# EAGLE design amp_project (EAGLE 9.6.2)
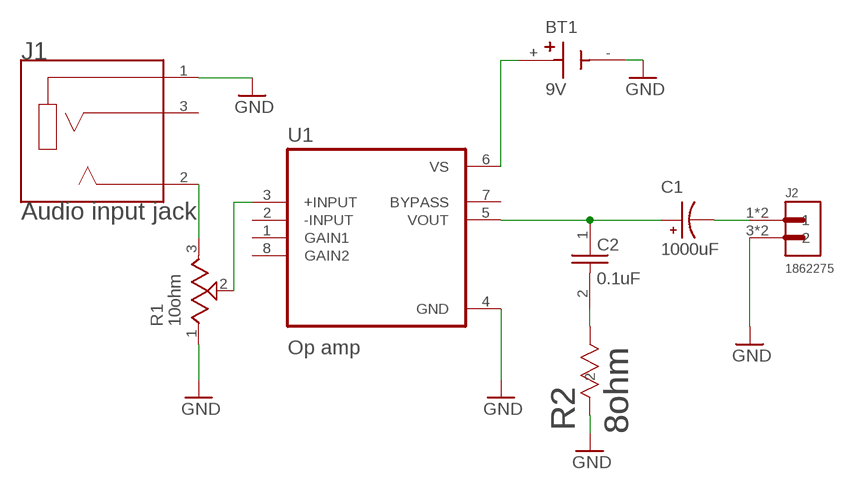
[diagram p0: schematic, sheet 1]

## Parts
BT1  9V  BH9VPC  [BAT_BH9VPC]
C1  1000uF  UPM1A102MHD6TO  [CAPPRD500W60D1250H1700]
C2  0.1uF  1C10X7R104K050B  [CAPRR254W51L508T318H635P]
J1  Audio input jack  SJ2-35853A-SMT-TR  [CUI_SJ2-35853A-SMT-TR]
J2  1862275  [PHOENIX_1862275]
R1  10ohm  3352T-1-103LF  [TRIM_3352T-1-103LF]
R2  8ohm  MRS25000C1009FCT00  [RES_MRS25_VIS]
U1  Op amp  LM386N-4/NOPB  [DIP794W45P254L959H508Q8]

## Nets
GND: BT1.- J1.1(SLEEVE) J2.3 J2.4 R1.1(CCW) R2.2 U1.4(GND)
N$1: J1.2(TIP) R1.3(CW)
N$2: R1.2(WIPER) U1.3(+INPUT)
N$3: BT1.+ U1.6(VS)
N$4: C1.P C2.1 U1.5(VOUT)
N$5: C1.N J2.1 J2.2
N$6: C2.2 R2.1
Unconnected: J1.3(RING) U1.1(GAIN1) U1.2(-INPUT) U1.7(BYPASS) U1.8(GAIN2)

## Library data of the parts
BT1 = BH9VPC:BH9VPC: 9V Battery Holder; DESCRIPTION: Battery Holder (Open) 9V 1 Cell PC Pin; DIGI-KEY_PART_NUMBER: BH9V-PC-ND; MF: MPD; MP: BH9VPC; PACKAGE: None; PURCHASE-URL: https://pricing.snapeda.com/search/part/BH9VPC/?ref=eda
C1 = UPM1A102MHD6TO:UPM1A102MHD6TO: CAP ALUM 1000UF 20% 10V RADIAL; DESCRIPTION: Cap Aluminum Lytic 1000uF 10V 20% (12.5 X 15mm) Radial 5mm 895mA 5000h 105°C Ammo; DIGI-KEY_PART_NUMBER: 493-12061-1-ND; MF: Nichicon; MP: UPM1A102MHD6TO; PACKAGE: Radial Nichicon; PURCHASE-URL: https://pricing.snapeda.com/search/part/UPM1A102MHD6TO/?ref=eda
C2 = 1C10X7R104K050B:1C10X7R104K050B: Cap Ceramic 0.1uF 50V X7R 10% Radial 2.54mm 125°C Bulk; DESCRIPTION: 0.1µF ±10% 50V Ceramic Capacitor X7R Radial; DIGI-KEY_PART_NUMBER: BC5209-ND; MF: Vishay BC; MP: 1C10X7R104K050B; PACKAGE: Radial Vishay; PURCHASE-URL: https://pricing.snapeda.com/search/part/1C10X7R104K050B/?ref=eda
J1 = SJ2-35853A-SMT-TR:SJ2-35853A-SMT-TR: 3 conductors, 3.5mm, SMT Audio Jack Check prices <https://pricing.snapeda.com/parts/SJ2-35853A-SMT-TR/CUI%20Devices/view-part?ref=eda>; AVAILABILITY: Good; CUI_PURCHASE_URL: https://www.cuidevices.com/product/interconnect/connectors/audio-connectors/jacks/sj2-3585x-smt-series?utm_source=snapeda.com&utm_medium=referral&utm_campaign=snapedaBOM; DESCRIPTION: 3.5 mm, Stereo, Right Angle, Surface Mount (SMT), 2~3 Conductors, 0~1 Internal Switches, Audio Jack Connector; MF: CUI Devices; MP: SJ2-35853A-SMT-TR; PACKAGE: None; PRICE: None; PURCHASE-URL: https://pricing.snapeda.com/search/part/SJ2-35853A-SMT-TR/?ref=eda
J2 = 1862275:1862275: PCB TERMINAL BLOCK 2POS 5MM; DESCRIPTION: 2 Position Wire to Board Terminal Block 45° (135°) Angle with Board 0.197 (5.00mm) Through Hole; DIGI-KEY_PART_NUMBER: 277-12139-ND; MF: Phoenix Contact; MP: 1862275; PACKAGE: None; PURCHASE-URL: https://pricing.snapeda.com/search/part/1862275/?ref=eda
R1 = 3352T-1-103LF:3352T-1-103LF: 10 kOhms 0.5W, 1/2W Through Hole Thumbwheel Potentiometer Top Adjustment; DESCRIPTION: 10 kOhms 0.5W, 1/2W Through Hole Thumbwheel Potentiometer Top Adjustment; DIGI-KEY_PART_NUMBER: 3352T-103LF-ND; MF: Bourns; MP: 3352T-1-103LF; PACKAGE: 2012 Bourns; PURCHASE-URL: https://pricing.snapeda.com/search/part/3352T-1-103LF/?ref=eda
R2 = 8ohmresistor:MRS25000C1009FCT00; BUILT_BY: EMA_UL_Team; MANUFACTURER_PART_NUMBER: MRS25000C1009FCT00; SOURCELIBRARY: Vishay_2020-02-10; VENDOR: Vishay
U1 = LM386N-4_NOPB:LM386N-4/NOPB; DESCRIPTION: Wide Input Voltage Low Power Audio Amplifier with Internal Gain 8-PDIP 0 to 70; DIGI-KEY_PART_NUMBER: 296-43960-5-ND; MF: Texas Instruments; MP: LM386N-4/NOPB; PACKAGE: PDIP-8 Texas; PURCHASE-URL: https://pricing.snapeda.com/search/part/LM386N-4/NOPB/?ref=eda

## Board
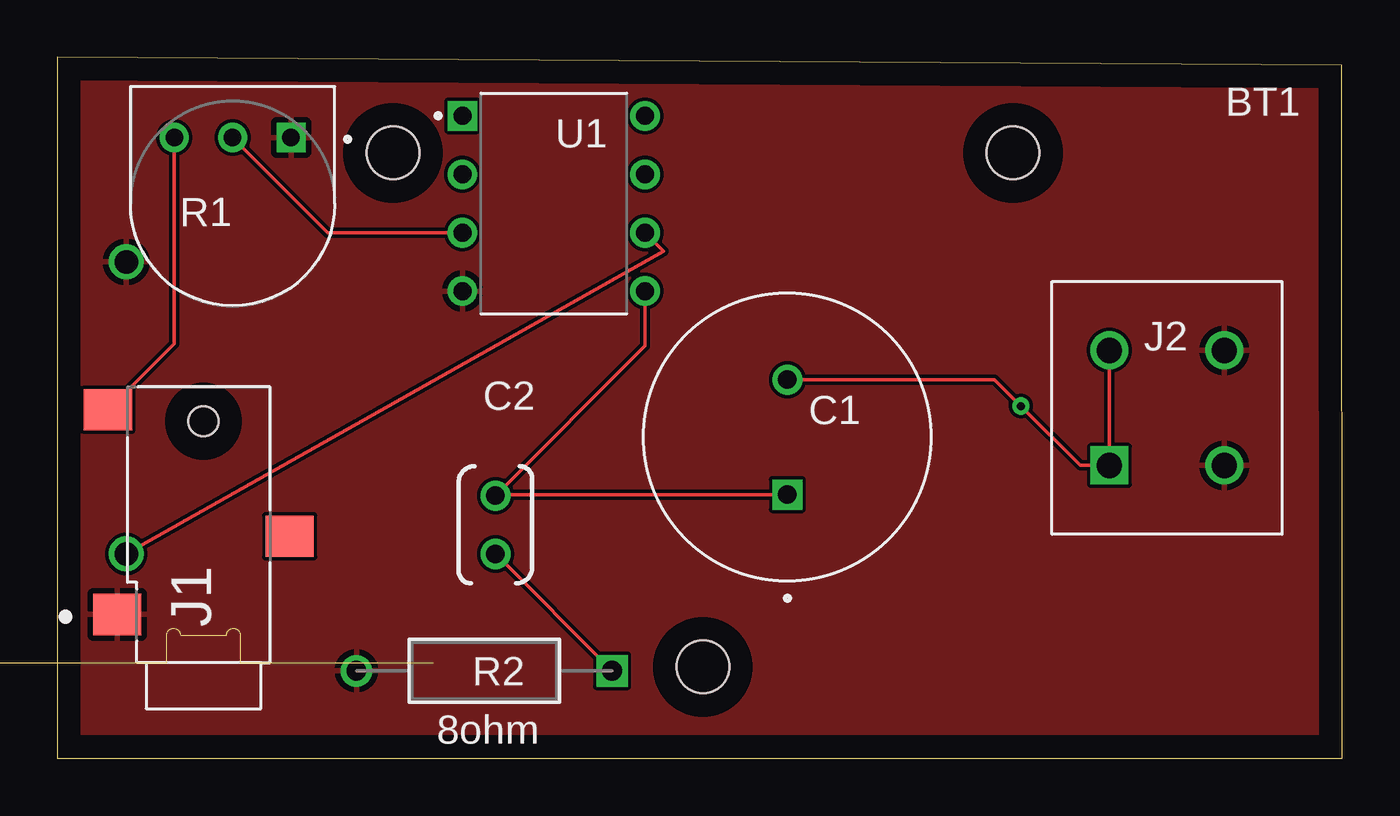
[diagram p1: board, top side]
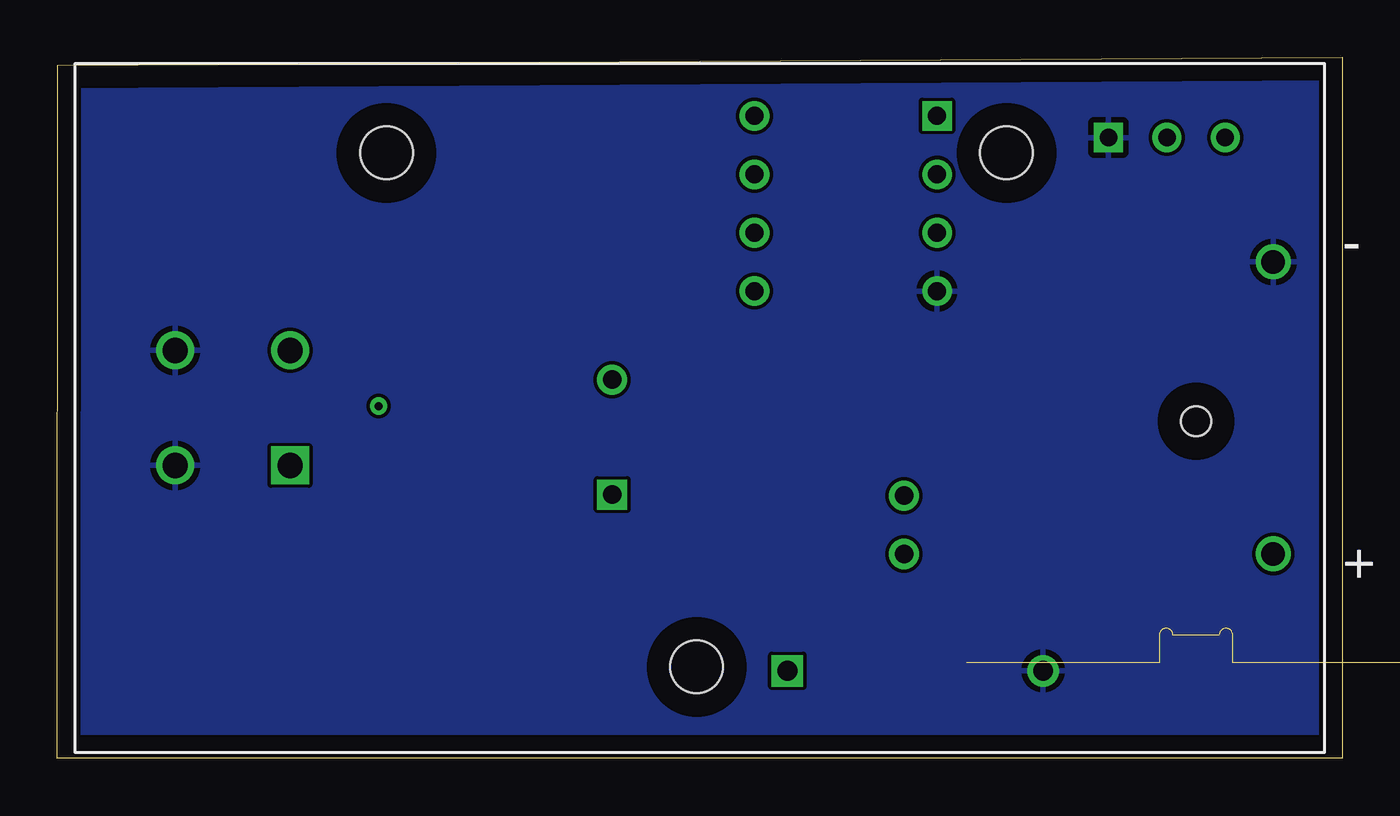
[diagram p2: board, bottom side, seen from below]

Size 55.88 x 30.48 mm. Coordinates in mm from the lower left corner, seen from the top.
Outline: 0,0 55.88,0 55.86,30.15 0,30.48 0,0
Copper layers (1*16): Top 0.035mm / dielectric 1.5mm / Bottom 0.035mm
Design rules "default": minimum track width 6mil, minimum drill 0.35mm, track to track 6mil, track to pad 6mil, pad to pad 6mil, via to via 6mil, smd to smd 6mil, copper to edge 40mil, drill to drill 6mil, minimum pad ring 10mil, minimum via ring 8mil, stop-mask expansion 4mil, vias tented up to drill 0mil, thermal gap 10mil

### Footprints (pad centres in the part's own frame; a part is rotated, then mirrored left to right if it is on the bottom)
BAT_BH9VPC = drill 1.016: + 24.945,-6.35; - 24.945,6.35 | hole 2.29: -0.135,-11.26; -13.625,11.09; 13.345,11.09
CAPPRD500W60D1250H1700 = drill 0.8 pad 1.15: N 2.5,0 | drill 0.8 pad 1.15 square: P -2.5,0
CAPRR254W51L508T318H635P = drill 0.8: 1 -1.27,0; 2 1.27,0
CUI_SJ2-35853A-SMT-TR = smd 1.8 x 2.1: 1 -3.9,3.75; 2 5,4.15; 3 -0.5,-3.75 | hole 1.3: 4.5,0
PHOENIX_1862275 = drill 1.1 square: 1 -2.5,-2.5 | drill 1.1: 2 -2.5,2.5; 3 2.5,-2.5; 4 2.5,2.5
TRIM_3352T-1-103LF = drill 0.76 pad 1.16 square: 1 -2.54,-2.87 | drill 0.76 pad 1.16: 2 0,-2.87; 3 2.54,-2.87
RES_MRS25_VIS = drill 0.864 pad 1.372 square: 1 0,0 | drill 0.864 pad 1.372: 2 11.125,0
DIP794W45P254L959H508Q8 = drill 0.78 pad 1.13 square: 1 -3.97,3.81 | drill 0.78 pad 1.13: 2 -3.97,1.27; 3 -3.97,-1.27; 4 -3.97,-3.81; 5 3.97,-3.81; 6 3.97,-1.27; 7 3.97,1.27; 8 3.97,3.81

### Placement (x,y rotation side)
BT1  27.94,15.24 0 bottom
C1  31.75,13.97 90 top
C2  19.05,10.16 270 top
J1  6.35,10.16 90 top
J2  48.26,15.24 0 top
R1  7.62,24.13 180 top
R2  24.13,3.81 180 top
U1  21.59,24.13 0 top

### Tracks (layer width: path | path; a pad name or v marks a point on that pad's centre or on a via)
GND
  pour Top: -10.16,101.6 -10.16,-17.78 -2.54,-25.4 172.72,-25.4 175.26,-22.86 175.26,88.9 158.75,105.41 -3.81,105.41 -8.89,100.33
  pour Bottom: -3.81,109.22 -2.54,110.49 161.29,110.49 163.83,107.95 163.83,-11.43 1.27,-11.43 -7.62,-2.54 -7.62,105.41
N$1
  Top 0.152: R1.3 5.08,18.04 J1.2
N$2
  Top 0.152: U1.3 11.76,22.86 R1.2
N$3
  Top 0.152: BT1.+ 26.37,22.05 U1.6
N$4
  Top 0.152: U1.5 25.56,17.94 C2.1 19.09,11.47 C1.P
N$5  (via drill 0.35)
  Top 0.152: J2.2 J2.1 44.49,12.74 v41.91,15.32 40.76,16.47 C1.N
N$6
  Top 0.152: C2.2 R2.1